# EAGLE schematic adaptive street ligth (EAGLE 9.5.2)
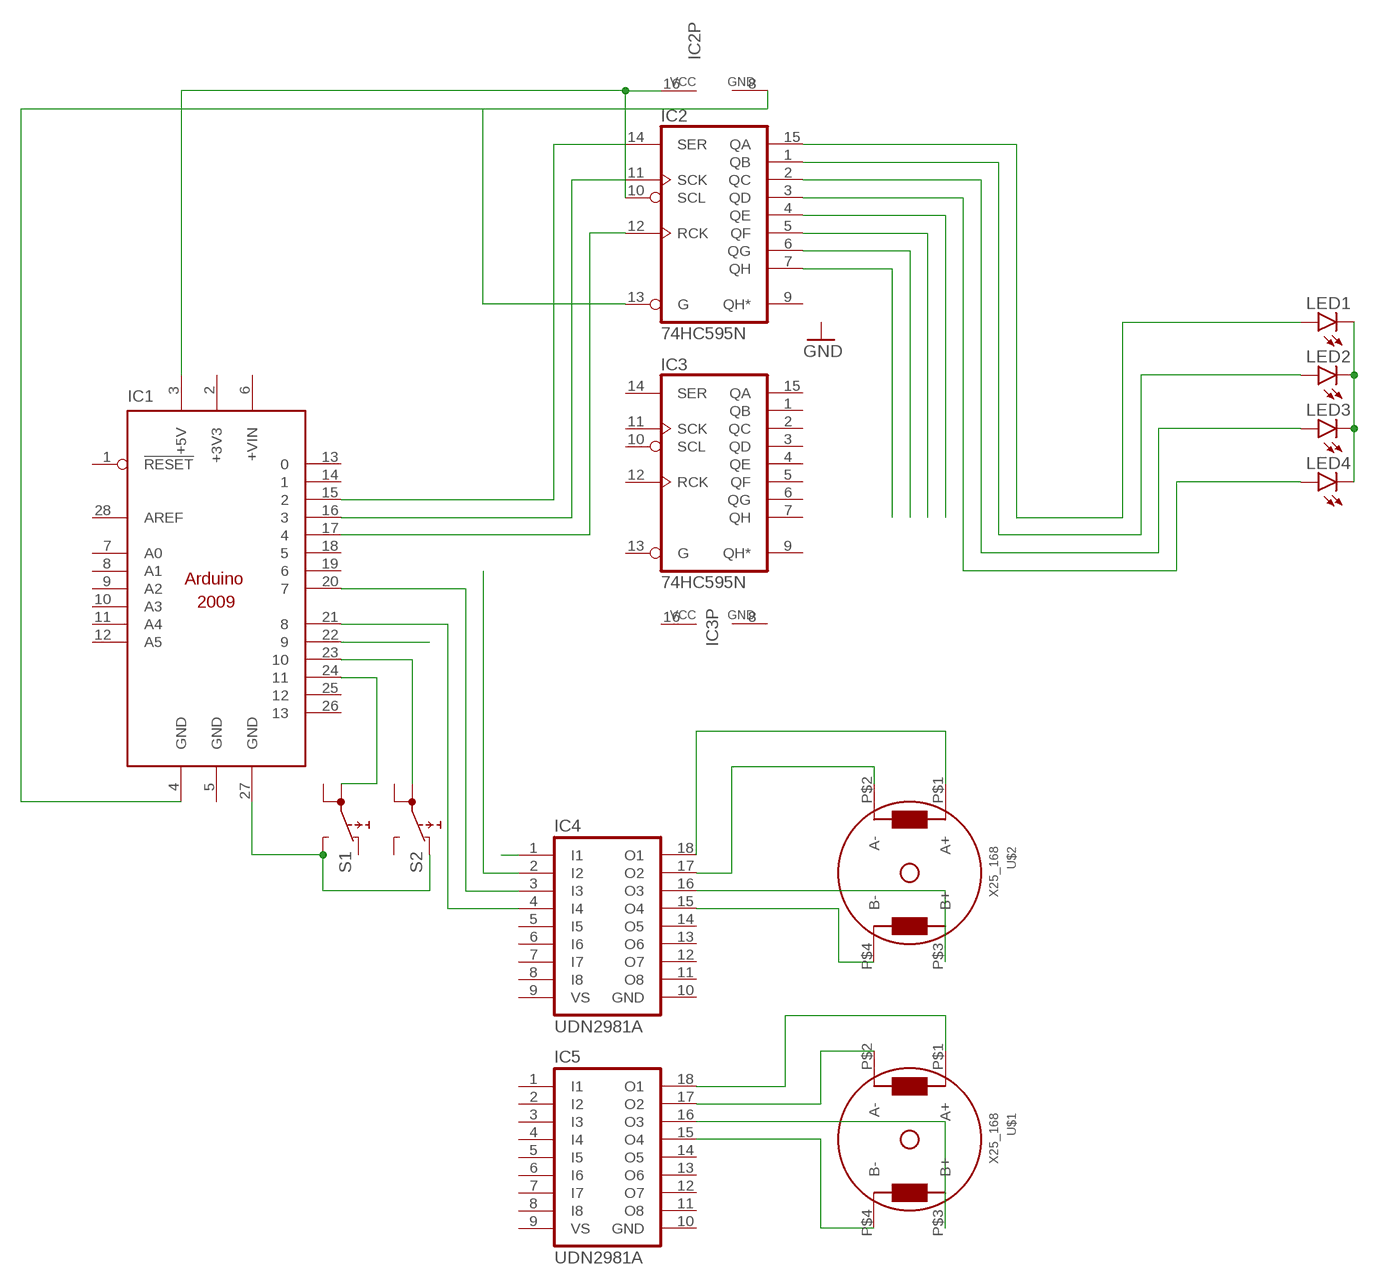
[diagram p0: schematic, sheet 1]

## Parts
IC1  ARDUINO2009_10  [ARDUINO2009]
IC2  74HC595N  [DIL16]
IC3  74HC595N  [DIL16]
IC4  UDN2981A  [DIL18]
IC5  UDN2981A  [DIL18]
LED1  TLLG4400  [LED3MM]
LED2  TLLG4400  [LED3MM]
LED3  TLLG4400  [LED3MM]
LED4  TLLG4400  [LED3MM]
S1  5501  [5501]
S2  5501  [5501]
U$1  X25_168  [X25_168]
U$2  X25_168  [X25_168]

## Nets
N$3: LED1.K(C) LED2.K(C) LED3.K(C) LED4.K(C)
N$5: IC4.1(I1)
N$6: IC4.2(I2)
N$7: IC1.20 IC4.3(I3)
N$8: IC1.21 IC4.4(I4)
N$9: IC1.22
N$10: IC1.23 S2.1A
N$11: IC1.24 S1.1A
N$12: IC1.27(GND) S1.NO S2.NC
N$13: IC4.18(O1) U$2.P$1(A+)
N$14: IC4.17(O2) U$2.P$2(A-)
N$15: IC4.16(O3) U$2.P$3(B+)
N$16: IC4.15(O4) U$2.P$4(B-)
N$17: IC5.18(O1) U$1.P$1(A+)
N$18: IC5.17(O2) U$1.P$2(A-)
N$19: IC5.16(O3) U$1.P$3(B+)
N$20: IC5.15(O4) U$1.P$4(B-)
N$21: IC2.1(QB) LED2.A
N$22: IC2.2(QC) LED3.A
N$23: IC2.3(QD) LED4.A
N$24: IC2.4(QE)
N$25: IC2.5(QF)
N$26: IC2.15(QA) LED1.A
N$29: IC1.15 IC2.14(SER)
N$30: IC1.16 IC2.11(SCK)
N$31: IC1.17 IC2.12(RCK)
N$32: IC1.4(GND) IC2.8(GND) IC2.13(G)
N$33: IC2.6(QG)
N$34: IC2.7(QH)
N$35: IC1.3(+5V) IC2.10(SCL) IC2.16(VCC)
Unconnected: IC1.1(!RESET) IC1.6(+VIN) IC1.7(A0) IC1.8(A1) IC1.9(A2) IC1.10(A3) IC1.11(A4) IC1.12(A5) IC1.13 IC1.14 IC1.18 IC1.19 IC1.25 IC1.26 IC1.28(AREF) IC2.9(QH*) IC3.1(QB) IC3.2(QC) IC3.3(QD) IC3.4(QE) IC3.5(QF) IC3.6(QG) IC3.7(QH) IC3.9(QH*) IC3.10(SCL) IC3.11(SCK) IC3.12(RCK) IC3.13(G) IC3.14(SER) IC3.15(QA) IC4.5(I5) IC4.6(I6) IC4.7(I7) IC4.8(I8) IC4.9(VS) IC4.11(O8) IC4.12(O7) IC4.13(O6) IC4.14(O5) IC5.1(I1) IC5.2(I2) IC5.3(I3) IC5.4(I4) IC5.5(I5) IC5.6(I6) IC5.7(I7) IC5.8(I8) IC5.9(VS) IC5.11(O8) IC5.12(O7) IC5.13(O6) IC5.14(O5) S1.1B S1.NC S2.1B S2.NO

## Power pins joined to a net without a drawn wire
+3V3: IC1.2(+3V3)
GND: IC1.5(GND) IC3.8(GND) IC4.10(GND) IC5.10(GND)
VCC: IC3.16(VCC)

## Library data of the parts
IC1 = arduino:ARDUINO2009_1: The Arduino Duemilanove ("2009") is a microcontroller board based on the ATmega168 or ATmega328. - 14 digital input/output pins (of which 6 can be used as PWM outputs) - 6 analog inputs, a 16 MHz crystal oscillator - USB connection - power jack - ISP header - reset button It contains everything needed to support the microcontroller; simply connect it to a computer with a USB cable or power it with a AC-to-DC adapter or battery to get started http://arduino.cc/en/Main/ArduinoBoardDuemilanove
IC2 IC3 = 74xx-eu:74*595: 8-bit SHIFT REGISTER, output latch
IC4 IC5 = uln-udn:UDN298*: DRIVER ARRAY Source: Allegro Microsystems Inc. / UDN2981-UDN2984.pdf
LED1-LED4 = led:TLLG4400: Low Current (2mA) LED 3 mm Tinted Diffused Package color GREEN Source: Data sheet <http://www.farnell.com/datasheets/391098.pdf>; MF: VISHAY SEMICONDUCTOR; OC_FARNELL: 1612435
S1 S2 = switch:55?: PUSHBUTTON SERIES 5500 SWITCHES Source: www.e-switch.com .. 5500.pdf
U$1 U$2 = x25_168:X25_168: X25168 - Miniature stepper motor for analog gauge